# EAGLE design smartproj_ready (EAGLE 9.6.0)
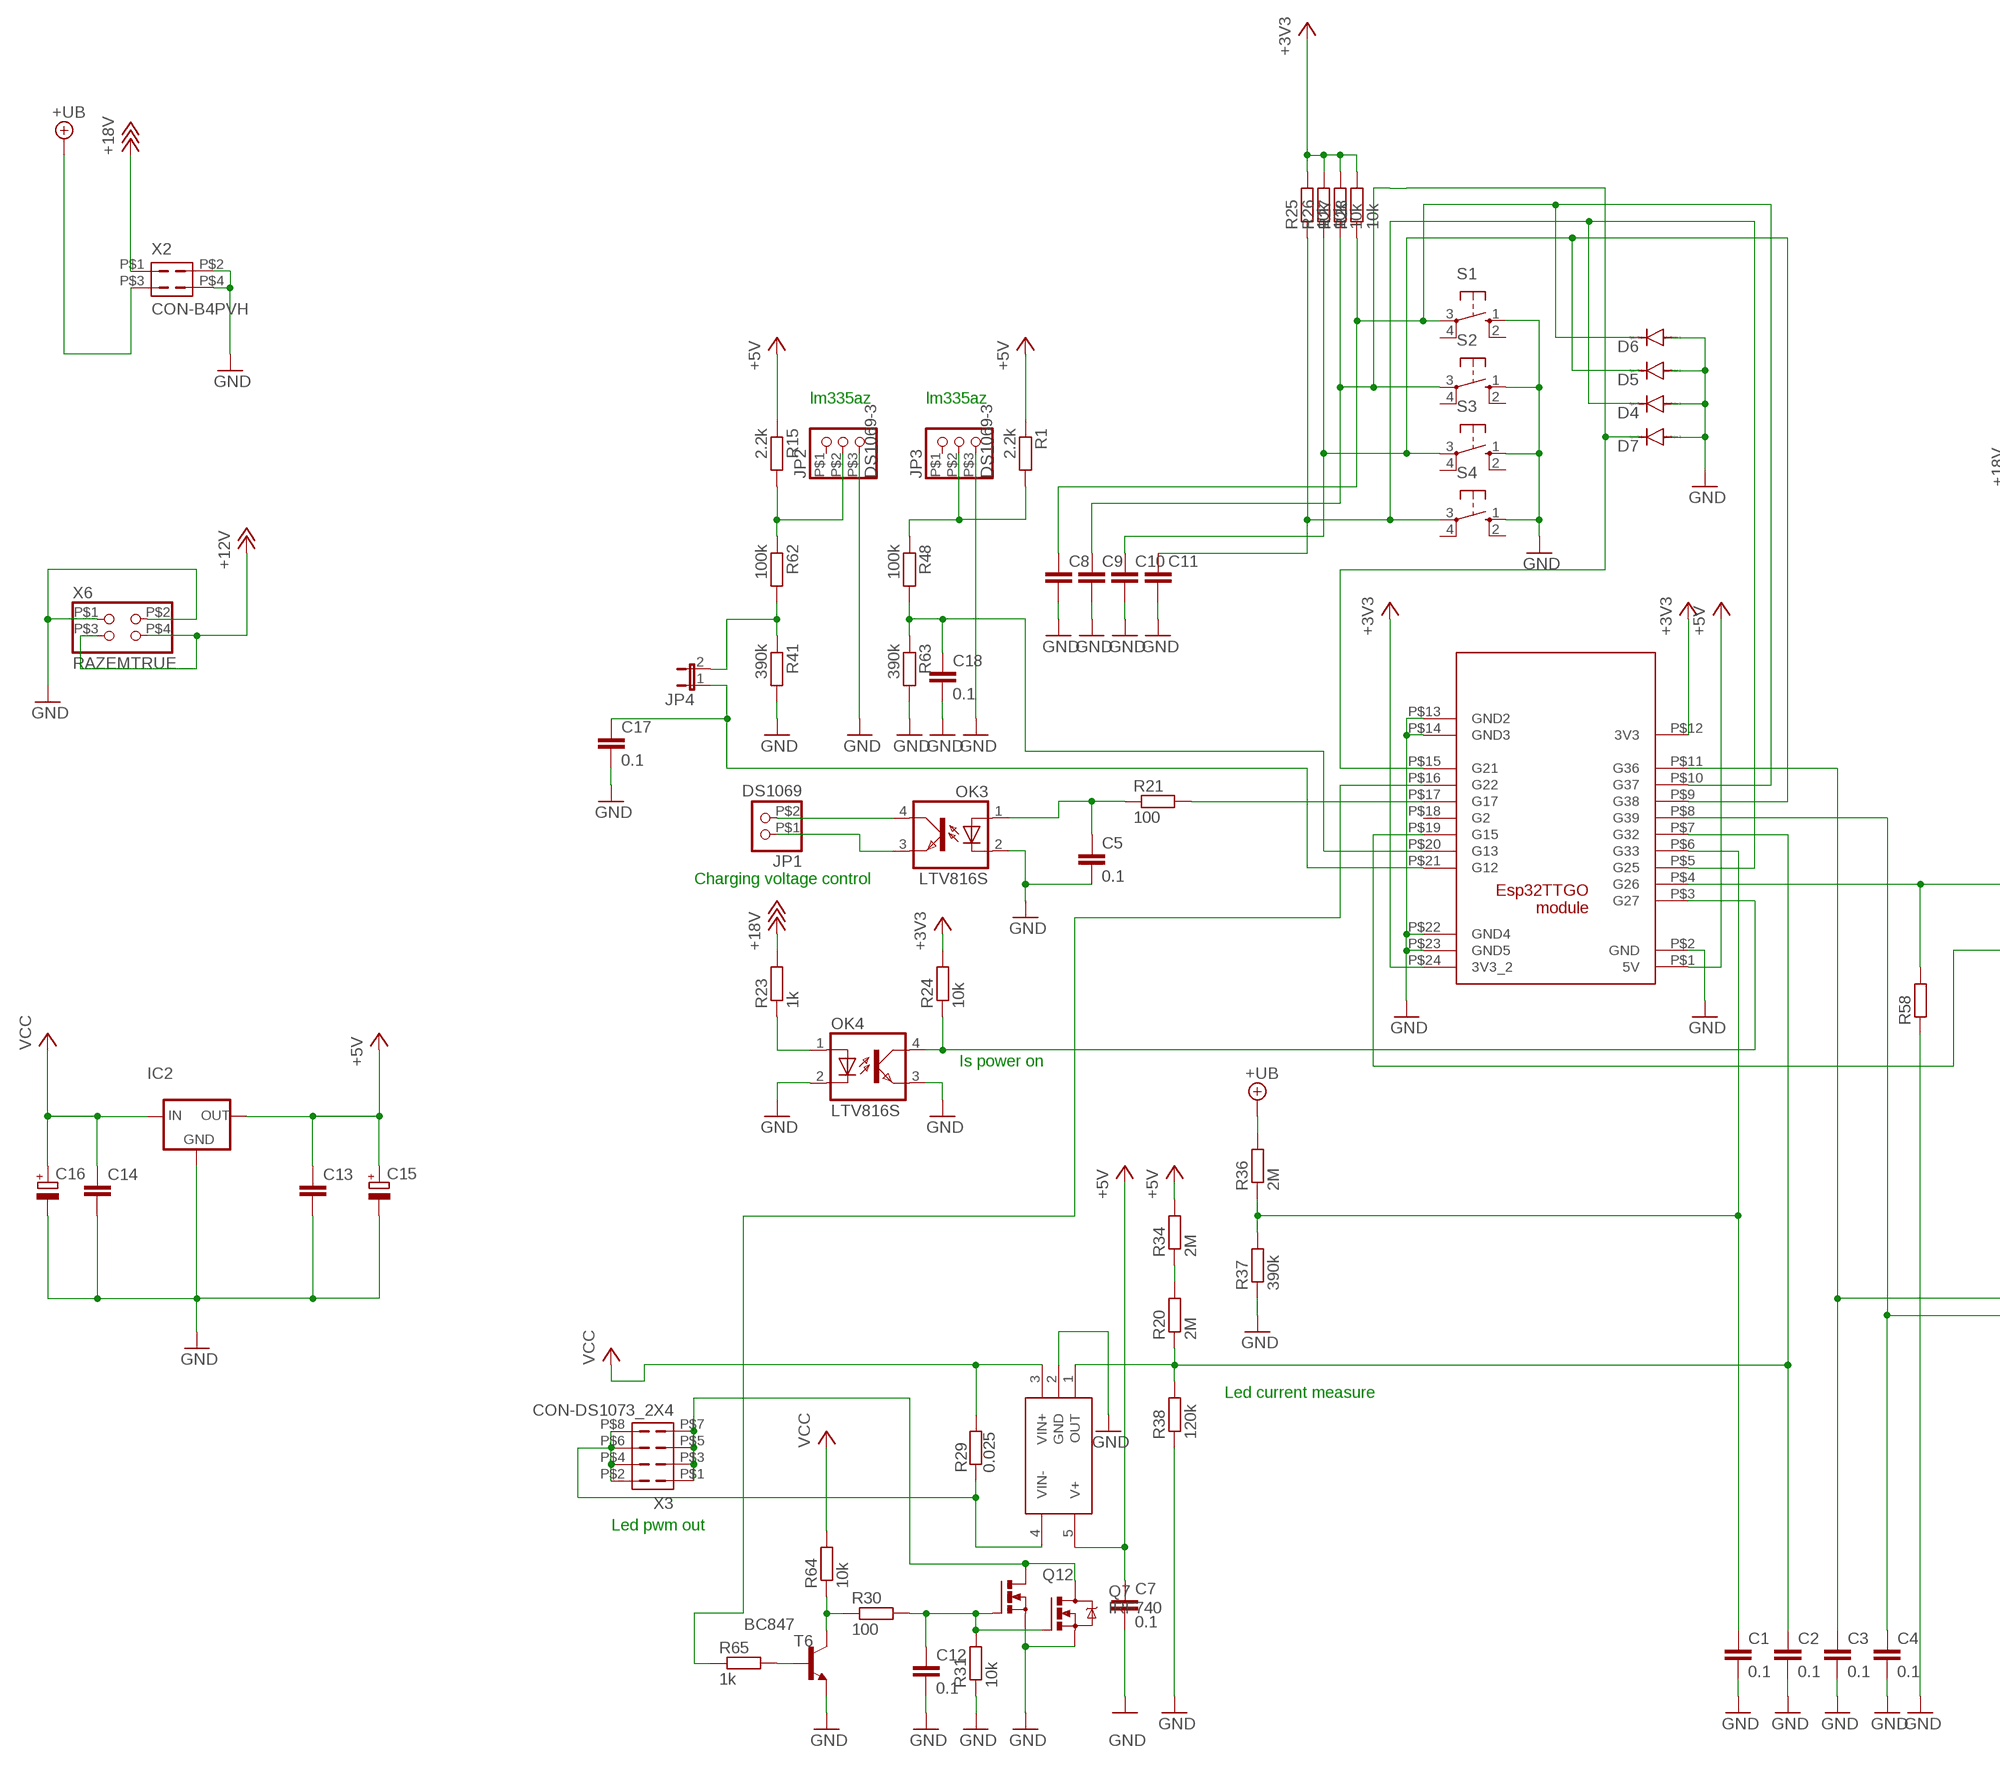
[diagram p0: schematic, sheet 1, part 1 of 2]
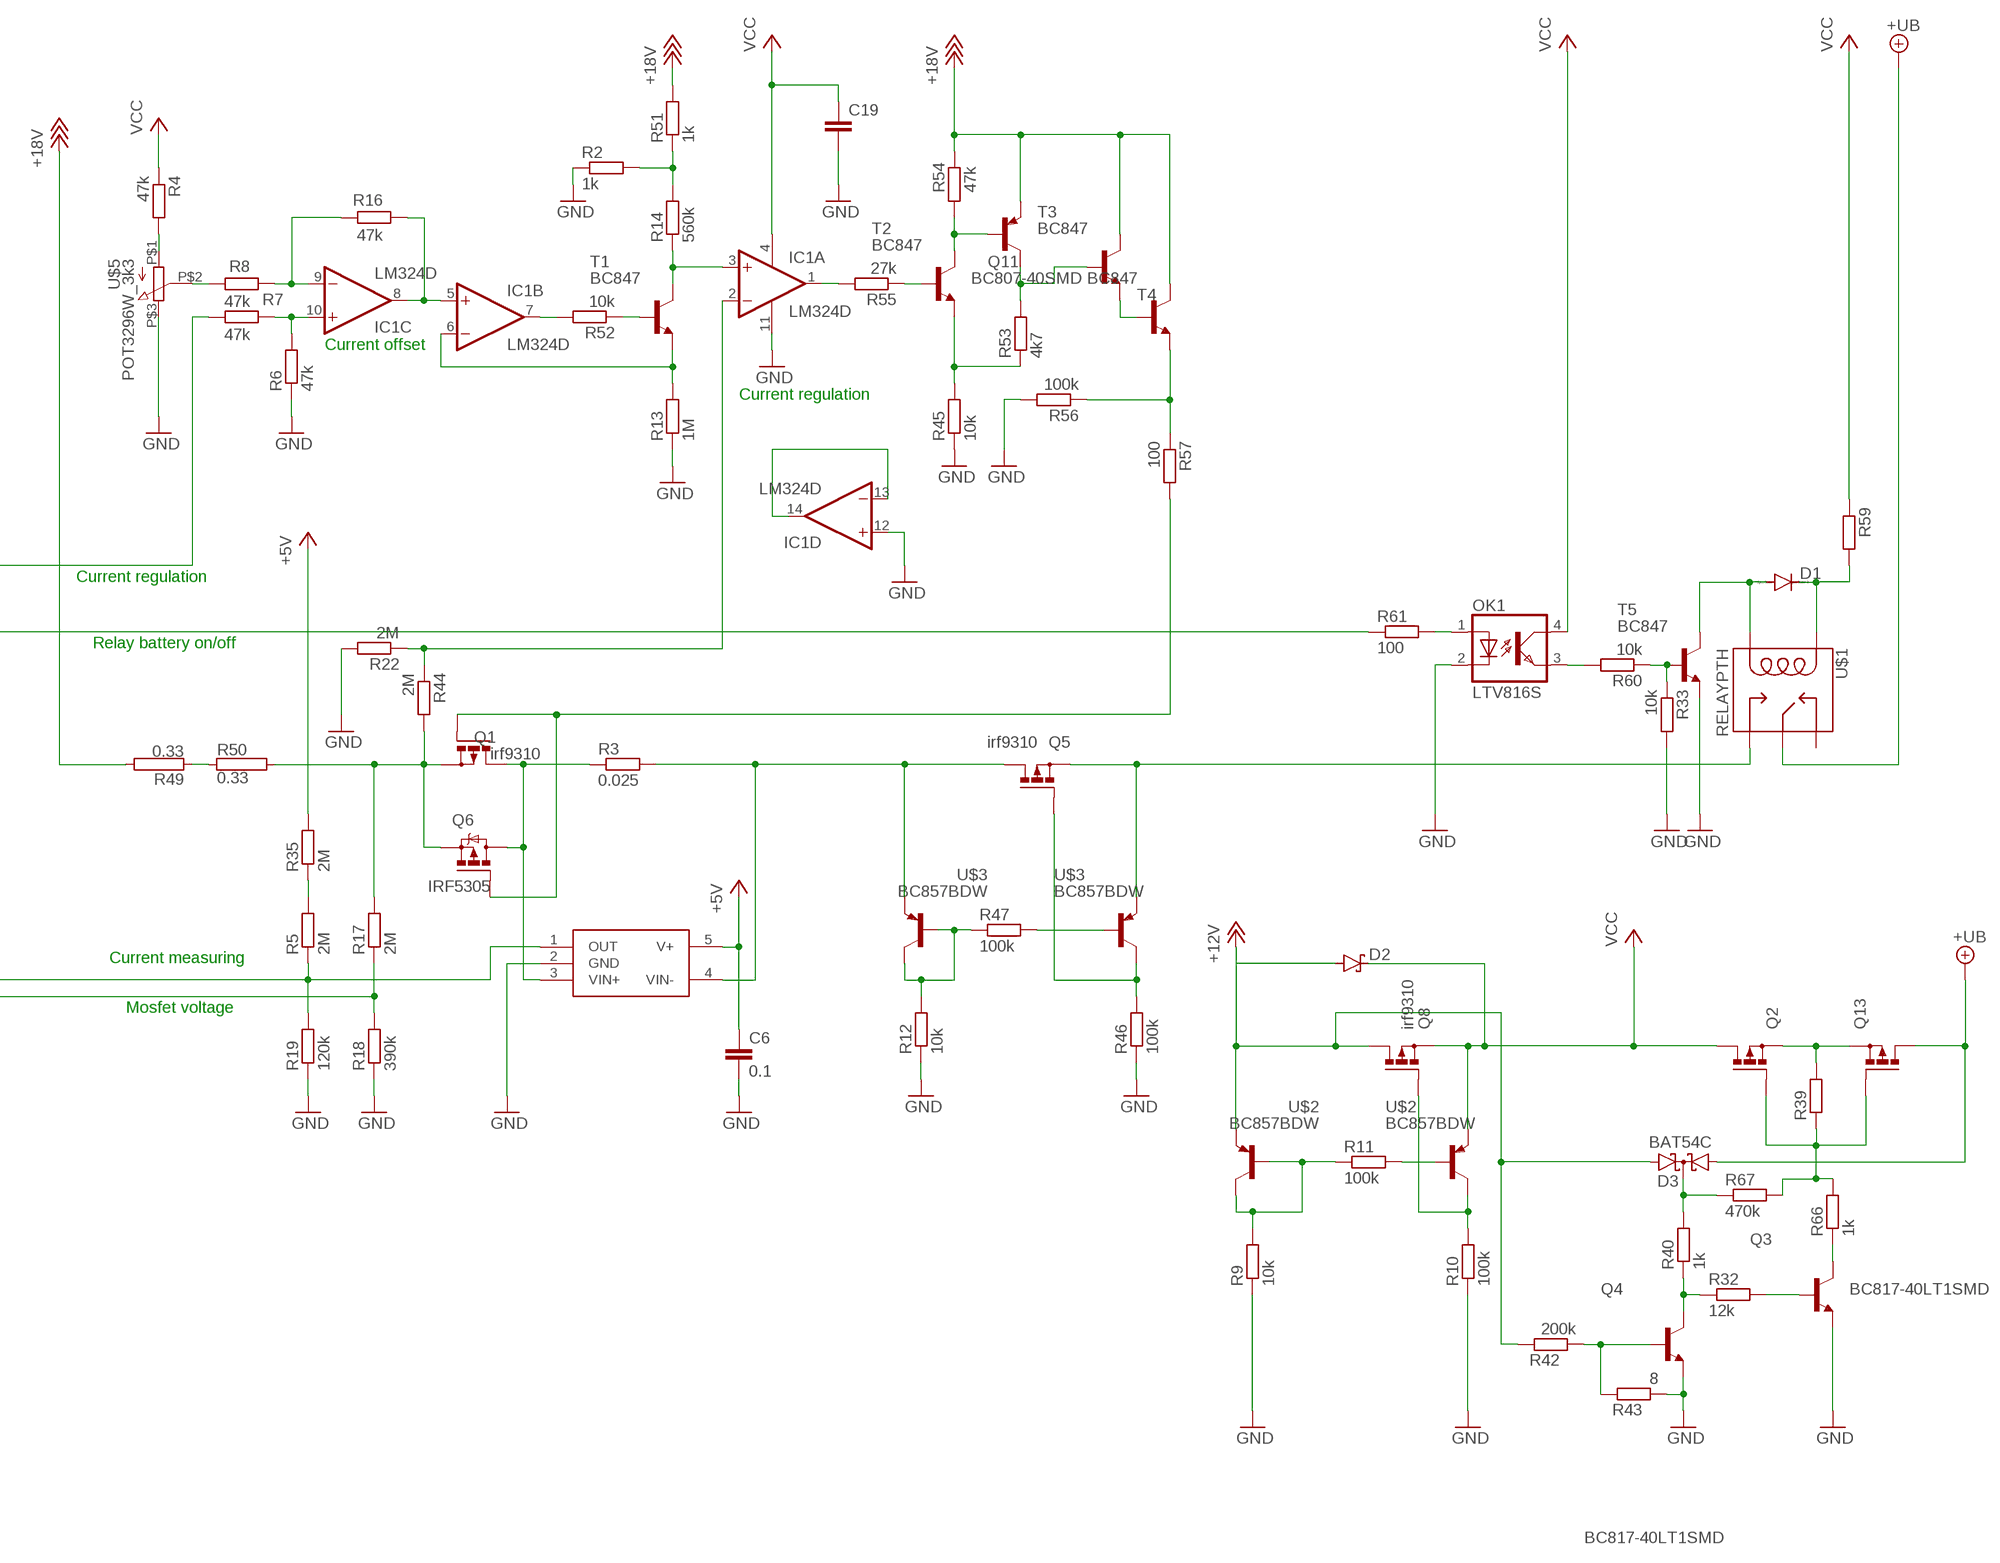
[diagram p1: schematic, sheet 1, part 2 of 2]

## Parts
C1  0.1  C-EUC0603K  [C0603K]
C2  0.1  C-EUC0603K  [C0603K]
C3  0.1  C-EUC0603K  [C0603K]
C4  0.1  C-EUC0603K  [C0603K]
C5  0.1  C-EUC0603K  [C0603K]
C6  0.1  C-EUC0603K  [C0603K]
C7  0.1  C-EUC0603K  [C0603K]
C8  C-EUC0603K  [C0603K]
C9  C-EUC0603K  [C0603K]
C10  C-EUC0603K  [C0603K]
C11  C-EUC0603K  [C0603K]
C12  0.1  C-EUC0603K  [C0603K]
C13  C-EUC0603  [C0603]
C14  C-EUC0603  [C0603]
C15  CPOL-EUSMCE  [SMC_E]
C16  CPOL-EUSMCE  [SMC_E]
C17  0.1  C-EUC0603K  [C0603K]
C18  0.1  C-EUC0603K  [C0603K]
C19  C-EUC0603K  [C0603K]
D1  DIODE-DO214AC  [DO214AC]
D2  SCHOTTKY-DIODESMC  [SMC]
D3  BAT54C  [SOT23]
D4  DIODE-SOD323-W  [SOD323-W]
D5  DIODE-SOD323-W  [SOD323-W]
D6  DIODE-SOD323-W  [SOD323-W]
D7  DIODE-SOD323-W  [SOD323-W]
IC1  LM324D  [SO14]
IC2  78XXS  [78XXS]
JP1  DS1069  [DS1069-2]
JP2  DS1069-3  [DS1069-3]
JP3  DS1069-3  [DS1069-3]
JP4  JP1E  [JP1]
OK1  LTV816S  [DIL4-SMD]
OK3  LTV816S  [DIL4-SMD]
OK4  LTV816S  [DIL4-SMD]
Q1  irf9310  P-MOSFET-SO8  [SO-08]
Q2  P-MOSFET-SO8  [SO-08]
Q3  BC817-40LT1SMD  [SOT23-BEC]
Q4  BC817-40LT1SMD  [SOT23-BEC]
Q5  irf9310  P-MOSFET-SO8  [SO-08]
Q6  IRF5305  IRF9530  [TO220BV]
Q7  IRF740  [TO220BV]
Q8  irf9310  P-MOSFET-SO8  [SO-08]
Q11  BC807-40SMD  [SOT23-BEC]
Q12  N-MOSFET-SO8S  [SO-08]
Q13  P-MOSFET-SO8  [SO-08]
R1  2.2k  R-EU_R0603  [R0603]
R2  1k  R-EU_R0603  [R0603]
R3  0.025  R-EU_R2512  [R2512]
R4  47k  R-EU_R0603  [R0603]
R5  2M  R-EU_R0603  [R0603]
R6  47k  R-EU_R0603  [R0603]
R7  47k  R-EU_R0603  [R0603]
R8  47k  R-EU_R0603  [R0603]
R9  10k  R-EU_R0603  [R0603]
R10  100k  R-EU_R0603  [R0603]
R11  100k  R-EU_R0603  [R0603]
R12  10k  R-EU_R0603  [R0603]
R13  1M  R-EU_R0603  [R0603]
R14  560k  R-EU_R0603  [R0603]
R15  2.2k  R-EU_R0603  [R0603]
R16  47k  R-EU_R0603  [R0603]
R17  2M  R-EU_R0603  [R0603]
R18  390k  R-EU_R0603  [R0603]
R19  120k  R-EU_R0603  [R0603]
R20  2M  R-EU_R0603  [R0603]
R21  100  R-EU_R0603  [R0603]
R22  2M  R-EU_R0603  [R0603]
R23  1k  R-EU_R0603  [R0603]
R24  10k  R-EU_R0603  [R0603]
R25  10k  R-EU_R0603  [R0603]
R26  10k  R-EU_R0603  [R0603]
R27  10k  R-EU_R0603  [R0603]
R28  10k  R-EU_R0603  [R0603]
R29  0.025  R-EU_R2512  [R2512]
R30  100  R-EU_R0603  [R0603]
R31  10k  R-EU_R0603  [R0603]
R32  12k  R-EU_R0603  [R0603]
R33  10k  R-EU_R0603  [R0603]
R34  2M  R-EU_R0603  [R0603]
R35  2M  R-EU_R0603  [R0603]
R36  2M  R-EU_R0603  [R0603]
R37  390k  R-EU_R0603  [R0603]
R38  120k  R-EU_R0603  [R0603]
R39  R-EU_R0603  [R0603]
R40  1k  R-EU_R0603  [R0603]
R41  390k  R-EU_R0603  [R0603]
R42  200k  R-EU_R0603  [R0603]
R43  8  R-EU_R0603  [R0603]
R44  2M  R-EU_R0603  [R0603]
R45  10k  R-EU_R0603  [R0603]
R46  100k  R-EU_R0603  [R0603]
R47  100k  R-EU_R0603  [R0603]
R48  100k  R-EU_R0603  [R0603]
R49  0.33  RCA4220  [CA4220]
R50  0.33  RCA4220  [CA4220]
R51  1k  R-EU_R0603  [R0603]
R52  10k  R-EU_R0603  [R0603]
R53  4k7  R-EU_R0603  [R0603]
R54  47k  R-EU_R0603  [R0603]
R55  27k  R-EU_R0603  [R0603]
R56  100k  R-EU_R0603  [R0603]
R57  100  R-EU_R0603  [R0603]
R58  R-EU_R0603  [R0603]
R59  R-EU_R1206  [R1206]
R60  10k  R-EU_R0603  [R0603]
R61  100  R-EU_R0603  [R0603]
R62  100k  R-EU_R0603  [R0603]
R63  390k  R-EU_R0603  [R0603]
R64  10k  R-EU_R0603  [R0603]
R65  1k  R-EU_R0603  [R0603]
R66  1k  R-EU_R0603  [R0603]
R67  470k  R-EU_R0603  [R0603]
S1  10-XX  [B3F-10XX]
S2  10-XX  [B3F-10XX]
S3  10-XX  [B3F-10XX]
S4  10-XX  [B3F-10XX]
T1  BC847  [SOT23]
T2  BC847  [SOT23]
T3  BC847  [SOT23]
T4  BC847  [SOT23]
T5  BC847  [SOT23]
T6  BC847  [SOT23]
U1  ESP32TTGO  [ESP32TTGODIP]
U3  INA138  [SOT23-DBV]
U4  INA138  [SOT23-DBV]
U$1  RELAYPTH  [SRD-05VDC-SL-C]
U$2  BC857BDW  [SOT363-INFINION]
U$3  BC857BDW  [SOT363-INFINION]
U$5  POT3296W_3k3  POT3296W  [3296W]
X2  CON-B4PVH  [B4PVH4]
X3  CON-DS1073_2X4  [DS1073_2X4]
X6  RAZEMTRUE  [DS1073_2X2N2]

## Nets
+3V3: R24.2 R25.2 R26.2 R27.2 R28.2 U1.P$12(3V3) U1.P$24(3V3_2)
+5V: C6.1 C7.1 C13.1 C15.+ IC2.OUT R1.1 R15.1 R34.2 R35.2 U1.P$1(5V) U3.5(V+) U4.5(V+)
+12V: D2.A D3.2(A2) Q8.5(D) Q8.6(D) Q8.7(D) Q8.8(D) R42.2 U$2.1(E1) X6.P$3 X6.P$4
+18V: Q11.E R23.2 R49.2 R51.2 R54.2 T3.3(C) T4.3(C) X2.P$1
+UB: D3.1(A1) Q13.5(D) Q13.6(D) Q13.7(D) Q13.8(D) R36.2 U$1.SWCOMMON X2.P$3
GND: C1.2 C2.2 C3.2 C4.2 C5.2 C6.2 C7.2 C8.2 C9.2 C10.2 C11.2 C12.2 C13.2 C14.2 C15.- C16.- C17.2 C18.2 C19.2 D4.A D5.A D6.A D7.A IC1.11(P:V-) IC1.12(D:+IN) IC2.GND JP2.P$3 JP3.P$3 OK1.2(C) OK3.2(C) OK4.2(C) OK4.3(EMIT) Q3.E Q4.E Q7.S Q12.1(S) Q12.2(S) Q12.3(S) R2.1 R6.1 R9.1 R10.1 R12.1 R13.1 R18.1 R19.1 R22.2 R31.1 R33.2 R37.1 R38.1 R41.2 R43.1 R45.1 R46.1 R56.2 R58.1 R63.2 S1.1(S) S2.1(S) S3.1(S) S4.1(S) T5.2(E) T6.2(E) U1.P$2(GND) U1.P$13(GND2) U1.P$14(GND3) U1.P$22(GND4) U1.P$23(GND5) U3.2(GND) U4.2(GND) U$5.P$3(E) X2.P$2 X2.P$4 X6.P$1 X6.P$2
N$1: R49.1 R50.1
N$2: OK1.3(EMIT) R60.2
N$3: Q4.B R42.1 R43.2
N$4: Q4.C R32.1 R40.1
N$5: Q3.B R32.2
N$6: Q2.4(G) Q13.4(G) R39.1 R66.2 R67.2
N$7: Q1.1(S) Q1.2(S) Q1.3(S) Q6.S R17.2 R44.2 R50.2
N$8: D3.3(CC) R40.2 R67.1
N$9: Q1.5(D) Q1.6(D) Q1.7(D) Q1.8(D) Q6.D R3.1 U3.3(VIN+)
N$10: R4.2 U$5.P$1(A)
N$11: IC1.10(C:+IN) R6.2 R7.1
N$12: IC1.9(C:-IN) R8.1 R16.2
N$13: C1.1 R36.1 R37.2 U1.P$6(G33)
N$14: R11.2 U$2.5(B)
N$15: R52.1 T1.1(B)
N$16: IC1.13(D:-IN) IC1.14(D:OUT)
N$17: R9.2 R11.1 U$2.2(B1) U$2.6(C1)
N$18: Q8.4(G) R10.2 U$2.3(C)
N$19: IC1.3(A:+IN) R14.1 T1.3(C)
N$20: Q5.4(G) R46.2 U$3.3(C)
N$21: IC1.6(B:-IN) R13.2 T1.2(E)
N$22: IC1.1(A:OUT) R55.2
N$23: R8.2 U$5.P$2(S)
N$24: R20.2 R34.1
N$25: IC1.5(B:+IN) IC1.8(C:OUT) R16.1
N$26: C5.1 OK3.1(A) R21.1
N$27: JP1.P$2 OK3.4(COL)
N$28: JP1.P$1 OK3.3(EMIT)
N$29: OK4.1(A) R23.1
N$30: IC1.2(A:-IN) R22.1 R44.1
N$31: R5.2 R35.1
N$32: R55.1 T2.1(B)
N$33: OK4.4(COL) R24.1 U1.P$3(G27)
N$34: R12.2 R47.1 U$3.2(B1) U$3.6(C1)
N$35: R30.1 R64.1 T6.3(C)
N$36: IC1.7(B:OUT) R52.2
N$37: C11.1 D4.C R25.1 S4.3(P) U1.P$5(G25)
N$38: C10.1 D5.C R26.1 S3.3(P) U1.P$9(G38)
N$39: R2.2 R14.2 R51.1
N$40: R47.2 U$3.5(B)
N$41: R45.2 R53.1 T2.2(E)
N$42: Q2.1(S) Q2.2(S) Q2.3(S) Q13.1(S) Q13.2(S) Q13.3(S) R39.2
N$43: Q5.1(S) Q5.2(S) Q5.3(S) U$1.SWOPEN U$3.4(E)
N$44: Q7.D Q12.5(D) Q12.6(D) Q12.7(D) Q12.8(D) X3.P$1 X3.P$3 X3.P$5 X3.P$7
N$45: R21.2 U1.P$17(G17)
N$46: R65.1 U1.P$16(G22)
N$47: R7.2 R58.2 U1.P$4(G26)
N$48: C3.1 R5.1 R19.2 U1.P$11(G36) U3.1(OUT)
N$49: Q11.C R53.2 T3.1(B)
N$50: C17.1 JP4.1 U1.P$21(G12)
N$51: C4.1 R17.1 R18.2 U1.P$8(G39)
N$52: Q5.5(D) Q5.6(D) Q5.7(D) Q5.8(D) R3.2 U3.4(VIN-) U$3.1(E1)
N$53: JP3.P$2 R1.2 R48.1
N$54: Q11.B R54.1 T2.3(C)
N$55: C2.1 R20.1 R38.2 U1.P$7(G32) U4.1(OUT)
N$56: JP2.P$2 R15.2 R62.1
N$57: C12.1 Q7.G Q12.4(G) R30.2 R31.2
N$58: R65.2 T6.1(B)
N$59: JP4.2 R41.1 R62.2
N$60: Q3.C R66.1
N$61: C18.1 R48.2 R63.1 U1.P$20(G13)
N$62: C8.1 D6.C R28.1 S1.3(P) U1.P$10(G37)
N$64: C9.1 D7.C R27.1 S2.3(P) U1.P$15(G21)
N$65: R56.1 R57.1 T4.2(E)
N$66: D1.A T5.3(C) U$1.COIL0
N$67: T3.2(E) T4.1(B)
N$68: Q1.4(G) Q6.G R57.2
N$69: D1.C R59.2 U$1.COIL1
N$71: R33.1 R60.1 T5.1(B)
N$72: R61.1 U1.P$19(G15)
N$73: OK1.1(A) R61.2
N$74: R29.1 U4.4(VIN-) X3.P$2 X3.P$4 X3.P$6 X3.P$8
VCC: C14.1 C16.+ C19.1 D2.C IC1.4(P:V+) IC2.IN OK1.4(COL) Q2.5(D) Q2.6(D) Q2.7(D) Q2.8(D) Q8.1(S) Q8.2(S) Q8.3(S) R4.1 R29.2 R59.1 R64.2 U4.3(VIN+) U$2.4(E)
Unconnected: JP2.P$1 JP3.P$1 S1.2(S1) S1.4(P1) S2.2(S1) S2.4(P1) S3.2(S1) S3.4(P1) S4.2(S1) S4.4(P1) U1.P$18(G2) U$1.SWCLOSED(SWCLOSE)

## Notes on the sheet
- lm335az | lm335az
- Current offset
- Current regulation
- Charging voltage control
- Current regulation
- Relay battery on/off
- Is power on
- Current measuring
- Mosfet voltage
- Led current measure
- Led pwm out

## Library data of the parts
C1-C14 C17-C19 = rcl:C-EU: CAPACITOR, European symbol; SPICEPREFIX: C
C15 C16 = rcl:CPOL-EU: POLARIZED CAPACITOR, European symbol; SPICEPREFIX: C
D1 D4-D7 = diode:DIODE-: DIODE
D2 = diode:SCHOTTKY-DIODE: Schottky Diode
D3 = diode:BAT54C: Schottky Diodes Source: Fairchild .. BAT54.pdf
IC1 = linear:LM324: OP AMP
IC2 = v-reg:78XXS: VOLTAGE REGULATOR
JP1 = ds1069:DS1069
JP2 JP3 = ds1069:DS1069-3
JP4 = jumper:JP1E: JUMPER
OK1 OK3 OK4 = optocoupler:LTV816: OPTO COUPLER Source: LITEON, LTV816.pdf
Q1 Q2 Q5 Q8 Q13 = transistor-power:P-MOSFET-SO8: P-Channel MOSFET Example: FDS4435A; P-Channel Logic Level PowerTrench® MOSFET FDS4465; P-Channel 1.8V Specified PowerTrench® MOSFET Source: www.fairchildsemi.com
Q3 Q4 = transistor-npn:BC817*: NPN Transistor
Q6 = transistor-power:IRF9530: P-CHANNEL HEXFET POWER-MOS-FET Source: http://www.irf.com/product-info/datasheets/data/irf9530.pdf
Q7 = transistor-power:IRF740: N-CHANNEL MOS FET
Q11 = transistor-pnp:BC807*: PNP Transistror
Q12 = transistor-power:N-MOSFET-SO8: N-Channel MOSFET Example: FDS7760A; N-Channel Logic Level PowerTrench® MOSFET FDS2572; N-Channel UltraFET® Trench MOSFET Source: www.fairchildsemi.com
R1 R4-R8 R15-R22 R30 R31 R34 R35 R38 R41 R44 R48 R62-R65 = resistor:R-EU_: RESISTOR, European symbol
R2 R3 R9-R14 R23-R29 R32 R33 R36 R37 R39 R40 R42 R43 R45-R47 R51-R61 R66 R67 = rcl:R-EU_: RESISTOR, European symbol; SPICEPREFIX: R
R49 R50 = resistor-power:R: Power Resitor; OC_FARNELL: unknown; OC_NEWARK: unknown
S1-S4 = switch-omron:10-XX: OMRON SWITCH; MPN: B3F-1000; OC_FARNELL: 176432; OC_NEWARK: 36M3542
T1-T6 = transistor:BC847: NPN TRANSISTOR
U1 = esp32TTGO:ESP32TTGO
U3 U4 = ina138:INA138
U$1 = srd:RELAY: SPDT relay (COM-00101)
U$2 U$3 = bc857bdw:BC857BDW
U$5 = pot3296W:POT3296W
X2 = b4pvh:CON-B4PVH
X3 = con-ds1073fpp:CON-DS1073_2X4
X6 = con-ds1073fpp:RAZEM

## Board
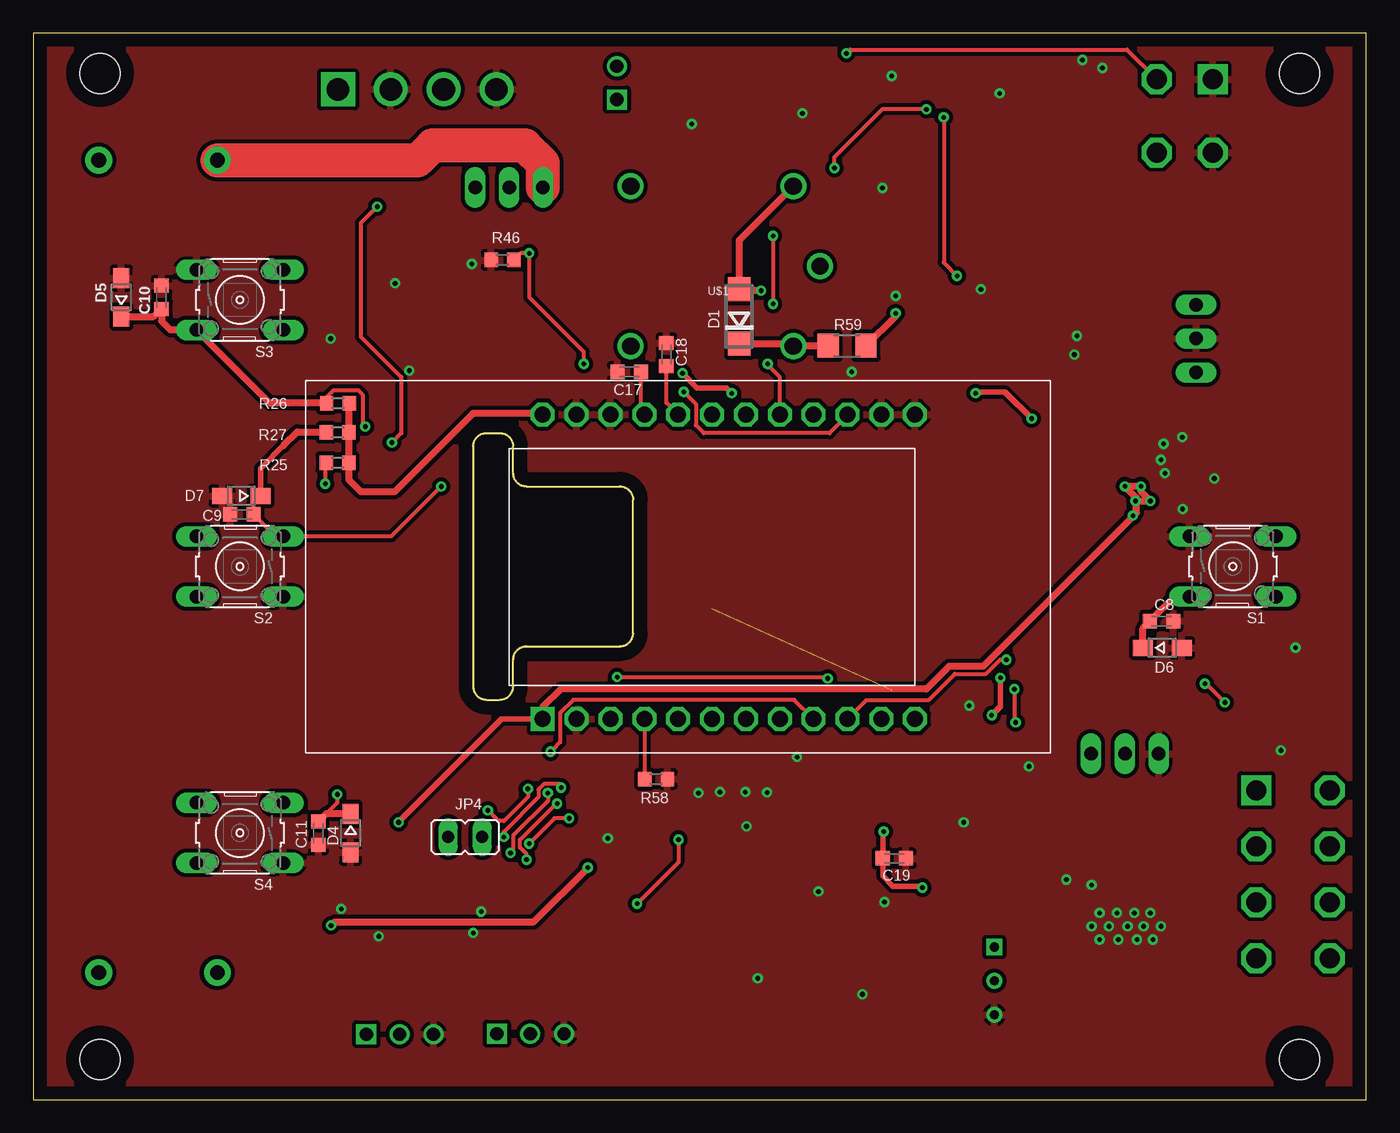
[diagram p2: board, top side]
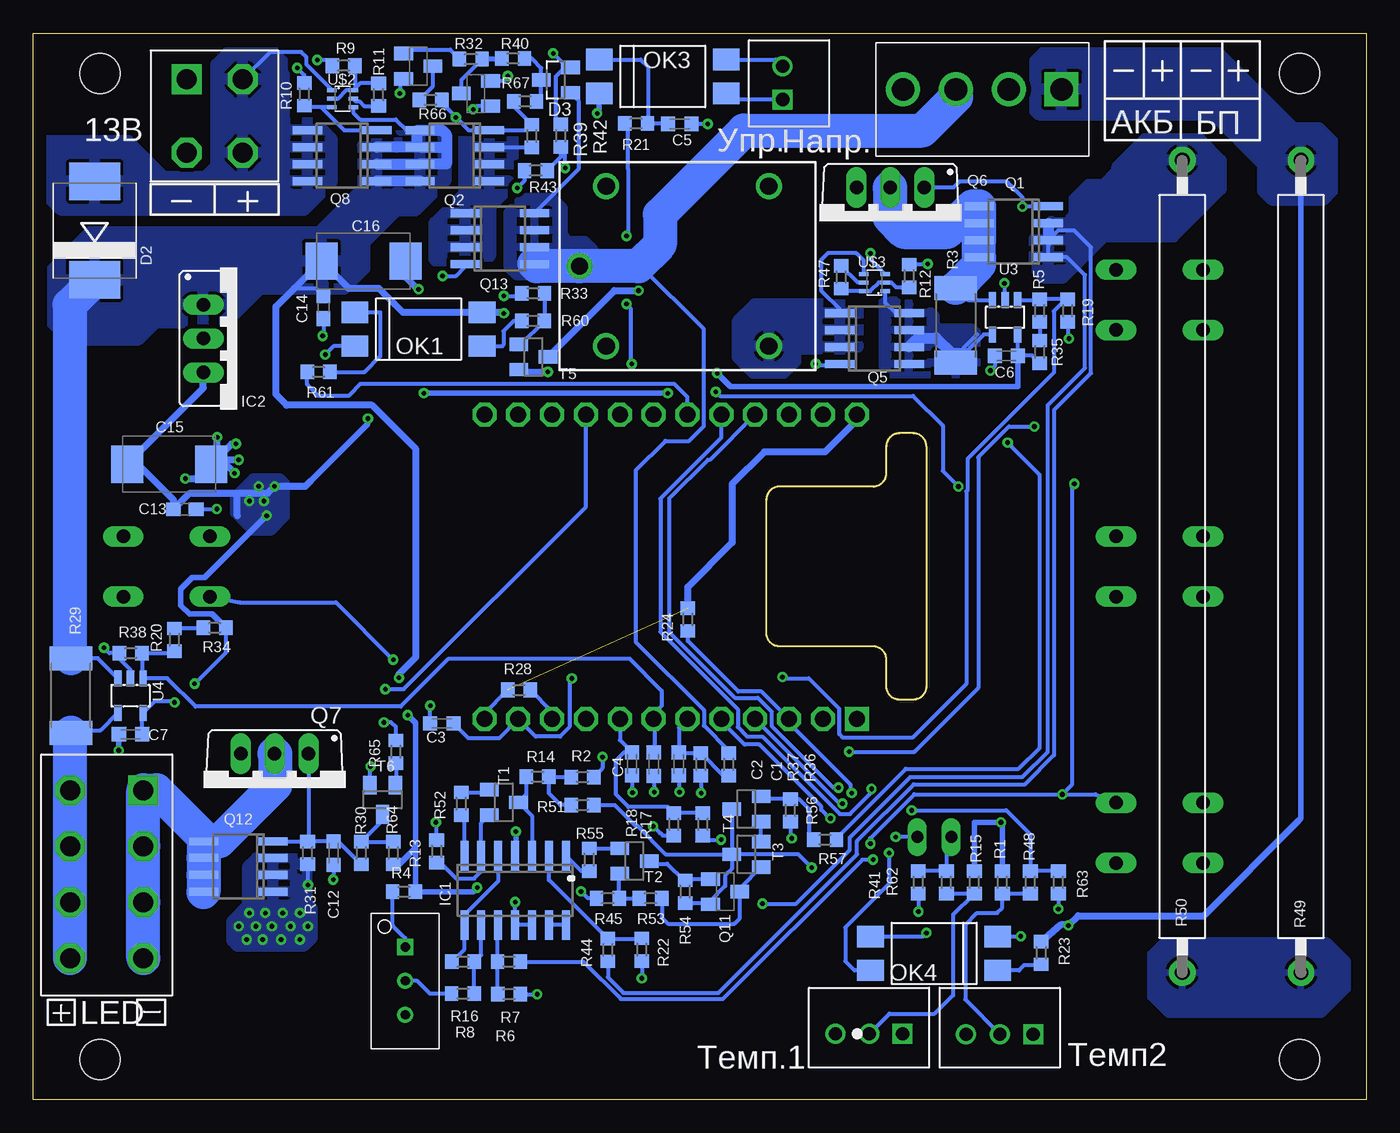
[diagram p3: board, bottom side, seen from below]

Size 100 x 80 mm. Coordinates in mm from the lower left corner, seen from the top.
Outline: 0,0 100,0 100,80 0,80 0,0
Outline: 33,49 33,31 arc90 34,30 35,30 arc90 36,31 36,33 arc-90 37,34 44,34 arc90 45,35 45,45 arc90 44,46 37,46 arc-90 36,47 36,49 arc90 35,50 34,50 arc90 33,49
Copper layers (1*16): Top 0.035mm / dielectric 1.5mm / Bottom 0.035mm
Design rules "default *": minimum track width 6mil, minimum drill 0.35mm, track to track 6mil, track to pad 6mil, pad to pad 6mil, via to via 6mil, smd to smd 6mil, copper to edge 40mil, drill to drill 6mil, minimum pad ring 10mil, minimum via ring 8mil, stop-mask expansion 4mil, vias tented up to drill 14mil, thermal gap 10mil
Holes 3 mm at 5,77 95,77 5,3 95,3
Milling: 16 lines

### Footprints (pad centres in the part's own frame; a part is rotated, then mirrored left to right if it is on the bottom)
C0603K = smd 1.05 x 1.08: 1 -0.875,0; 2 0.875,0
C0603 = smd 1.1 x 1: 1 -0.85,0; 2 0.85,0
SMC_E = smd 2.4 x 2.8: + -3.15,0; - 3.15,0
DO214AC = smd 1.8 x 1.7: A 2.05,0; C -2.05,0
SMC = smd 2.8 x 3.8: A 3.7,0; C -3.7,0
SOT23 = smd 1 x 1.4: 1 -0.95,-1.1; 2 0.95,-1.1; 3 0,1.1
SOD323-W = smd 1.5 x 1.2: A 1.45,0; C -1.45,0
SO14 = smd 0.6 x 2.2: 1 -3.81,-2.6; 2 -2.54,-2.6; 3 -1.27,-2.6; 4 0,-2.6; 5 1.27,-2.6; 6 2.54,-2.6; 7 3.81,-2.6; 8 3.81,2.6; 9 2.54,2.6; 10 1.27,2.6; 11 0,2.6; 12 -1.27,2.6; 13 -2.54,2.6; 14 -3.81,2.6
78XXS = drill 1.016 long: GND 0,-2.54; IN -2.54,-2.54; OUT 2.54,-2.54
DS1069-2 = drill 1 square: P$1 -1.25,0 | drill 1: P$2 1.25,0
DS1069-3 = drill 1 square: P$1 -2.52,0 | drill 1: P$2 -0.02,0; P$3 2.52,0
JP1 = drill 0.914 long: 1 0,-1.27; 2 0,1.27
DIL4-SMD = smd 1.6 x 2: 1 -1.27,-4.77; 2 1.27,-4.77; 3 1.27,4.77; 4 -1.27,4.77
SO-08 = smd 0.6 x 2.2: 1 -1.905,-2.6; 2 -0.635,-2.6; 3 0.635,-2.6; 4 1.905,-2.6; 5 1.905,2.6; 6 0.635,2.6; 7 -0.635,2.6; 8 -1.905,2.6
SOT23-BEC = smd 1 x 1.4: B -0.95,-1.1; C 0,1.1; E 0.95,-1.1
TO220BV = drill 1.016 long: D 0,-2.54; G -2.54,-2.54; S 2.54,-2.54
R0603 = smd 1 x 1.1: 1 -0.85,0; 2 0.85,0
R2512 = smd 1.8 x 3.2: 1 -2.8,0; 2 2.8,0
CA4220 = drill 1.1 pad 2: 1 -30.48,0; 2 30.48,0
R1206 = smd 1.6 x 1.803: 1 -1.422,0; 2 1.422,0
B3F-10XX = drill 1.016 long: 1 -3.251,2.261; 2 3.251,2.261; 3 -3.251,-2.261; 4 3.251,-2.261
ESP32TTGODIP = drill 1.2 square: P$1 -11.43,11.43 | drill 1.2 octagon: P$2 -11.43,8.89; P$3 -11.43,6.35; P$4 -11.43,3.81; P$5 -11.43,1.27; P$6 -11.43,-1.27; P$7 -11.43,-3.81; P$8 -11.43,-6.35; P$9 -11.43,-8.89; P$10 -11.43,-11.43; P$11 -11.43,-13.97; P$12 -11.43,-16.51; P$13 11.43,-16.51; P$14 11.43,-13.97; P$15 11.43,-11.43; P$16 11.43,-8.89; P$17 11.43,-6.35; P$18 11.43,-3.81; P$19 11.43,-1.27; P$20 11.43,1.27; P$21 11.43,3.81; P$22 11.43,6.35; P$23 11.43,8.89; P$24 11.43,11.43
SOT23-DBV = smd 0.55 x 1.2: 1 -0.95,-1.3; 2 0,-1.3; 3 0.95,-1.3; 4 0.95,1.3; 5 -0.95,1.3
SRD-05VDC-SL-C = drill 1.3: COIL0 -6.1,-6; COIL1 -6.1,6; SWCLOSED 6.1,-6; SWCOMMON -8.1,0; SWOPEN 6.1,6
SOT363-INFINION = smd 0.3 x 0.7: 1 -0.65,-0.8; 2 0,-0.8; 3 0.65,-0.8; 4 0.65,0.8; 5 0,0.8; 6 -0.65,0.8
3296W = drill 0.7 square: P$1 0,2.54 | drill 0.7: P$2 0,0; P$3 0,-2.54
B4PVH4 = drill 1.7 square: P$1 -5.94,0 | drill 1.7: P$2 -1.98,0; P$3 1.98,0; P$4 5.94,0
DS1073_2X4 = drill 1.5 square: P$1 -6.3,2.75 | drill 1.5 octagon: P$2 -6.3,-2.75; P$3 -2.1,2.75; P$4 -2.1,-2.75; P$5 2.1,2.75; P$6 2.1,-2.75; P$7 6.3,2.75; P$8 6.3,-2.75
DS1073_2X2N2 = drill 1.5 square: P$1 2.715,7.645 | drill 1.5 octagon: P$2 2.715,2.145; P$3 6.915,7.645; P$4 6.915,2.145

### Placement (x,y rotation side)
C1  51.57,25.18 270 bottom
C2  53.44,25.17 270 bottom
C3  69.34,28.22 180 bottom
C4  55.08,25.18 270 bottom
C5  51.5,73.21 0 bottom
C6  27,55.8 180 bottom
C7  92.7,27.4 180 bottom
C8  84.65,35.9 0 top
C9  15.65,43.9 180 top
C10  9.62,60.2 90 top
C11  21.39,19.99 270 top
C12  77.47,18.49 270 bottom
C13  88.63,44.29 0 bottom
C14  78.23,59.44 270 bottom
C15  89.81,47.67 0 bottom
C16  75.24,62.9 0 bottom
C17  44.7,54.6 180 top
C18  47.5,55.9 90 top
C19  64.6,18.1 0 top
D1  52.97,58.76 90 top
D2  95.4,65.2 90 bottom
D3  60.8,76.5 90 bottom
D4  23.8,20 270 top
D5  6.6,60.2 90 top
D6  84.7,33.9 0 top
D7  15.6,45.3 180 top
IC1  63.85,15.7 180 bottom
IC2  84.7,57.1 270 bottom
JP1  43.79,76.28 90 bottom
JP2  37.3,4.94 180 bottom
JP3  27.5,4.9 180 bottom
JP4  32.4,19.7 90 top
OK1  71.1,57.8 270 bottom
OK3  52.78,76.76 270 bottom
OK4  32.42,10.96 90 bottom
Q1  26.44,65.11 90 bottom
Q2  68.39,70.82 90 bottom
Q3  71.12,77.53 270 bottom
Q4  66.8,75.48 90 bottom
Q5  36.9,57.1 270 bottom
Q6  35.7,65.9 180 bottom
Q7  81.9,23.4 180 bottom
Q8  76.83,70.82 90 bottom
Q11  48.1,15.6 270 bottom
Q12  84.62,17.48 90 bottom
Q13  65,64.6 270 bottom
R1  27.3,16.3 270 bottom
R2  58.8,24.2 180 bottom
R3  30.8,58.1 270 bottom
R4  72.19,15.59 180 bottom
R5  24.5,59.2 270 bottom
R6  64.31,7.9 180 bottom
R7  64.32,10.35 0 bottom
R8  67.77,7.95 180 bottom
R9  76.72,77.57 0 bottom
R10  79.67,75.42 270 bottom
R11  74.1,75.4 270 bottom
R12  34.3,61.8 270 bottom
R13  69.74,18.62 270 bottom
R14  62.17,24.22 0 bottom
R15  29.4,16.3 270 bottom
R16  67.75,10.34 0 bottom
R17  49.77,20.65 270 bottom
R18  51.95,20.65 90 bottom
R19  22.4,59.2 90 bottom
R20  89.4,34.5 90 bottom
R21  54.77,73.23 180 bottom
R22  54.35,11.25 270 bottom
R23  24.38,10.99 90 bottom
R24  50.9,36.01 90 bottom
R25  22.83,47.78 0 top
R26  22.86,52.25 0 top
R27  22.84,50.05 0 top
R28  63.56,30.73 180 bottom
R29  97.19,30.31 90 bottom
R30  75.39,18.49 270 bottom
R31  79.42,18.51 90 bottom
R32  67.18,78.07 180 bottom
R33  62.5,60.5 180 bottom
R34  86.4,35.4 0 bottom
R35  24.5,56.1 270 bottom
R36  47.83,25.15 90 bottom
R37  49.92,25.15 90 bottom
R38  92.7,33.5 0 bottom
R39  62.6,72.3 270 bottom
R40  63.99,78.12 0 bottom
R41  33.6,16.3 270 bottom
R42  60.44,72.32 90 bottom
R43  62.3,69.7 0 bottom
R44  56.9,11.22 270 bottom
R45  56.9,15.1 0 bottom
R46  35.2,63 0 top
R47  39.4,61.7 90 bottom
R48  25.2,16.3 90 bottom
R49  4.9,40 90 bottom
R50  13.8,40 90 bottom
R51  58.8,22.1 0 bottom
R52  67.9,22.2 270 bottom
R53  53.7,15.1 0 bottom
R54  51.1,15.6 270 bottom
R55  58.3,18 270 bottom
R56  43.2,21.7 270 bottom
R57  40.6,19.5 0 bottom
R58  46.73,24.05 180 top
R59  61.05,56.56 180 top
R60  62.51,58.42 180 bottom
R61  78.6,54.6 0 bottom
R62  31.5,16.3 90 bottom
R63  23.1,16.3 270 bottom
R64  73,18.5 270 bottom
R65  72.8,26.1 270 bottom
R66  70.2,75 0 bottom
R67  63.1,74.9 180 bottom
S1  90,40 0 top
S2  15.5,40 180 top
S3  15.5,60 0 top
S4  15.5,20 180 top
T1  64.7,22.3 270 bottom
T2  54.9,17.9 270 bottom
T3  46.5,18.4 90 bottom
T4  46.5,21.8 90 bottom
T5  62.48,55.72 270 bottom
T6  73.8,22.5 180 bottom
U1  49.65,39.97 90 top
U3  27.1,58.7 180 bottom
U4  92.7,30.3 180 bottom
U$1  50.92,62.53 180 top
U$2  76.8,75.1 270 bottom
U$3  36.9,61.3 90 bottom
U$5  72.1,8.9 0 bottom
X2  28.8,75.8 180 bottom
X3  94.5,16.9 270 bottom
X6  91.2,68.9 0 bottom

### Tracks (layer width: path | path; a pad name or v marks a point on that pad's centre or on a via)
+3V3  (1 unrouted)
  Top 0.508: U1.P$24 38.14,51.48 32.98,51.48 27.09,45.58 24.58,45.58 23.68,46.48 R25.2 23.68,50.04 R27.2 23.69,52.22 R26.2
  Bottom 0.305: U1.P$12 66.16,28.98 R28.2
  Bottom 0.508: U1.P$24 38.22,50.98 40.6,48.6 45.15,48.6 47.57,46.18 47.57,41.79 50.9,38.46 R24.2
+5V  (via drill 0.35)
  Top 0.305: v89.4,29.8 88,31.2 v87.9,31.2
  Top 0.406: v52.4,53 52,53.4 49.8,53.4 v48.7,54.5 | v70.7,53 70.8,53.1 72.9,53.1 v74.9,51.1 | U1.P$1 35.12,28.54 27.48,20.9 27.48,20.88 v27.4,20.8
  Top 0.508: U1.P$1 38.22,29.44 39.58,30.8 67,30.8 68.7,32.5 71.25,32.5 82.77,44.02 82.77,45.14 v81.9,46.01 v83.1,46.01 83.1,45.61 v83.8,44.91 v82.7,44.91
  Bottom 0.305: C7.1 91.83,28.92 U4.5 90.86,29.89 89.49,29.89 v89.4,29.8 | U3.5 26.12,57.38 C6.1 26.15,55.83 25.07,55.83 R35.2 | v87.9,31.2 85.55,33.55 R34.2
  Bottom 0.406: C6.1 26.12,53.5 47.7,53.5 v48.7,54.5 | v70.7,53 v52.4,53 | 79.2,46.4 74.9,50.7 v74.9,51.1 | R1.1 27.3,20.8 v27.4,20.8 29.4,20.8 R15.1 | R34.2 86.57,36.42 88.27,36.42 88.93,37.08 88.93,38.3 88.07,39.16 87.15,39.16 v82.5,43.81
  Bottom 0.508: 79.2,46.4 79.59,46.01 v81.9,46.01 82.4,45.51 84.7,45.51 | 84.7,43.78 84.7,45.51 | IC2.OUT 87.24,53.38 C15.+ 92.15,47.66 89.48,44.99 C13.1 88.26,45.51 84.7,45.51
  pour Bottom: 81.4,46.7 83.6,46.7 85,45.3 85,44 83.6,42.6 82.1,42.6 81,43.7 81,46.3
+12V  (via drill 0.35)
  Top 0.305: v61,78.5 61.28,78.78 82.05,78.78 X6.P$3
  Bottom 0.305: U$2.1 79.5,77.65 79.5,78.2 79.9,78.6 82.23,78.6 X6.P$3 | v61,78.5 59.95,77.45 D3.2 60.1,77.45 60.8,76.75 60.8,73.54 R42.2
  pour Bottom (isolate 0.305): 77.6,72.1 77.6,68.8 79.7,66.7 97.9,66.7 99.9,68.7 99.9,71.7 99.6,72 92.9,72 90.2,69.3 87.1,69.3 86.3,70.1 86.3,77.7 85.2,78.8 82.2,78.8 81.2,77.8 81.2,73.3 78.8,73.3
+18V  (via drill 0.35)
  Top 0.508: v41.6,17.4 37.5,13.3 22.58,13.3 v22.34,13.06
  Bottom 0.305: R54.2 49.3,14.75 Q11.E 49.2,14.92 48.09,16.02 48.09,16.8 47.6,17.3 T3.3 | T4.3 T3.3 | v41.6,17.4 42.6,18.4 T3.3 | R51.2 56.39,22.1 54.84,20.55 54.72,20.55 52.57,18.4 T3.3
  Bottom 0.406: 5.1,20.9 4.9,21.1 R49.2
  Bottom 0.508: R23.2 22.86,13.14 v22.34,13.06 21.6,13.8 12.2,13.8 5.1,20.9
  pour Bottom (isolate 0.406): 2.5,71.9 3.5,72.9 5.4,72.9 11.2,78.7 24.1,78.7 24.9,77.9 24.9,74.2 24.6,73.9 11.5,73.9 7.8,70.2 7.8,68.2 7.1,67.5 3.2,67.5 2.5,68.2
+UB
  Bottom 0.305: R36.2 47.83,26.19 49.7,28.06 49.7,29.22 54.81,34.34 54.81,47.18 52.58,49.41 50.8,49.41 49.7,50.52 49.7,57.8 54.43,62.53 54.62,62.53 | D3.1 59.1,74.95 59.1,69.81 Q13.8
  Bottom 2.54: X2.P$3 30.78,75.22 33.3,72.7 46.7,72.7 53,66.4 53,64.15 54.62,62.53 U$1.SWCOMMON 62.23,62.53 Q13.5
  pour Bottom (isolate 0.305): 60.2,66.9 61,67.7 63.3,67.7 64.4,66.6 64.4,62.4 63.8,61.8 58,61.8 57.9,61.9 57.9,63.8 58.6,64.5 59.8,64.5 60.2,64.9
GND  (via drill 0.35)
  Bottom 0.305: R31.1 79.42,16.12 v79.4,16.1 | C1.2 51.57,23.12 v51.52,23.07 | v53.42,23.07 53.44,23.09 C2.2 | v70.22,29.55 C3.2 | C4.2 55.08,23.06 v55.05,23.03 | OK4.2 v25.93,12.23 v25.92,12.24 | v33,12.5 33.27,12.23 OK4.3 | R56.2 43.2,19.7 v43.1,19.6 | R45.1 58.4,15.1 v58.91,15.61 | v57.3,25.7 57.3,24.85 R2.1 | R13.1 69.74,20.74 v69.8,20.8 | v63.85,14.81 IC1.11 IC1.12 | R22.2 v54.35,9.09 | C13.2 86.25,44.29 v86.23,44.31 | v27.15,61.25 27.15,60.05 U3.2 | C6.2 27.88,55.02 v28.2,54.7 | R19.1 22.4,57.2 v22.3,57.1 | R37.1 49.92,23.02 v49.9,23 | R6.1 v62.2,7.9 | C12.2 77.47,16.53 v77.5,16.5 | R18.1 52.75,19.8 52.95,20 53,20 v53.5,20.5 | R12.1 34.25,62.7 v32.9,62.7 | v64.7,60.3 63.35,60.3 R33.2 | R10.1 79.67,76.87 v80.2,77.4 | Q4.E 64.67,76.42 64.4,76.7 v64.4,76.8 | Q3.E 72.5,76.29 v72.5,75.5 | R43.1 63.15,68.95 v63.7,68.4 | C14.2 78.23,57.37 v78.3,57.3 | R9.1 78,78 v78.7,78 | R63.2 v23.1,14.3 | R41.2 v33.6,14.1 | OK1.2 77.47,56.53 v78.1,55.9 | U4.2 92.7,32.25 93.55,33.1 R38.1 94.3,33.5 v94.7,33.9 | C5.2 v49.41,73.21 v49.4,73.2 | T6.2 74.75,24.95 v74.7,25
  Bottom 0.406: C7.2 93.58,26.23 v93.6,26.2 | OK3.2 57.55,74.15 v57.7,74
  Bottom 0.508: C16.- 72.08,61.7 71.18,60.8 v71.1,60.8 | C15.- 85.12,49.2 v84.8,49.2 | v84.6,48 86.3,48 86.31,48.01 C15.- | C15.- 85.56,47.66 v84.9,47 | C15.- 86.2,48.12 v86.2,49.7 | v88.6,46.6 87.72,46.6 C15.- | T5.2 63.41,54.6 v61.4,54.6
  other vias: 79.4,13 81.4,12 80,12 80,14 82.8,12 84.6,13 81.3,14 82.6,14 83.8,14 83.3,13 82.1,13 80.7,13 84,12
  pour Bottom: 79.5,17.3 79.5,14.8 79.1,14.4 79.1,12.1 79.7,11.5 84.7,11.5 85.1,11.9 85.1,13.4 83.9,14.6 83.9,17.5 83.3,18.1 80.3,18.1
  pour Top (isolate 0.305): 0,80 0,0 100,0 100,80
N$1
  pour Bottom: 2.9,11.9 15.2,11.9 16.2,10.9 16.2,7.7 14.9,6.4 3.3,6.4 1.4,8.3 1.4,10.4
N$2
  Bottom 0.305: R60.2 63.96,58.42 64.73,57.65 64.73,56.63 64.83,56.53 OK1.3
N$3  (via drill 0.35)
  Top 0.305: v67,74.3 63.7,74.3 60.1,70.7 v60.1,69.9
  Bottom 0.305: R43.2 60.44,70.71 R42.1 60.1,71.13 v60.1,69.9 | Q4.B 66.78,74.53 v67,74.3
N$4
  Bottom 0.305: R32.1 64.89,78.07 R40.1 66.24,78.12 67.9,76.46 Q4.C
N$5
  Bottom 0.305: Q3.B 71.92,78.78 68.73,78.78 R32.2
N$6  (via drill 0.35)
  Top 0.305: v68.3,73.7 68.3,62.8 v69.3,61.8
  Bottom 0.305: v69.3,61.8 68.3,61.8 67.6,62.5 Q13.4 | R67.2 63.95,74.5 R39.1 63.02,72.73 Q2.4 67.33,72.73 v68.3,73.7 69.35,74.75 R66.2
N$7  (via drill 0.35)
  Top 0.305: v48.4,19.5 48.4,17.8 v45.3,14.7
  Top 2.54: R50.2 13.82,70.46 28.83,70.46 29.95,71.59 36.91,71.59 38.24,70.25 Q6.S
  Bottom 0.305: R17.2 49.47,19.5 v48.4,19.5 | R44.2 56.9,9.17 55.73,8 48.6,8 38.2,18.4 38.2,19.4 33.94,23.66 25.6,23.66 23.42,25.84 23.42,51.72 20.64,54.49 20.64,63.95 21.9,65.2 23.11,65.2 Q1.2 | 23.84,64.11 Q1.1 22.44,63.2 21.1,61.86 21.1,54.9 23.9,52.1 23.9,26.1 25.8,24.2 34.2,24.2 38.74,19.66 38.74,18.72 42.77,14.7 v45.3,14.7
  Bottom 0.813: Q1.3 Q1.2
  pour Bottom (isolate 0.406): 24.9,62.4 24.9,64.6 20.8,68.7 19.7,68.7 18.7,69.7 18.7,70 16.6,72.1 12.5,72.1 10.9,70.5 10.9,68.3 14.5,64.7 19.7,64.7 22.8,61.6 24.1,61.6
N$8
  Bottom 0.305: R40.2 62.62,78.12 61.9,77.4 D3.3 61.9,75.25 R67.1
N$9
  Bottom 0.305: R3.1 29.9,60 U3.3
  Bottom 2.54: R3.1 29.04,62.66 Q1.8 Q1.7 | Q1.7 Q1.6 | Q1.7 Q1.5 29.53,67.02 31.45,65.09 34.66,65.09 35.74,66.17 35.74,68.4 Q6.D
N$10
  Bottom 0.305: U$5.P$1 72.1,12.1 73.04,13.04 R4.2
N$11
  Bottom 0.305: IC1.10 65.1,13.08 65.17,13.01 R7.1 R6.2
N$12
  Bottom 0.305: R8.1 66.92,10.32 R16.2 66.39,10.85 IC1.9
N$13
  Bottom 0.305: U1.P$6 51.57,27.89 C1.1 51.52,26 R37.2 48.22,24.3 R36.1
N$14
  Bottom 0.305: U$2.5 75.81,74.91 75.52,74.91 75.17,74.55 R11.2
N$15
  Bottom 0.305: T1.1 66,23.05 R52.1
N$16
  Bottom 0.305: IC1.14 IC1.13
N$17
  Bottom 0.305: U$2.6 76.48,75.75 77.13,75.1 U$2.2 | R11.1 75.5,76.25 U$2.6 | R9.2 75.87,75.88 U$2.6
N$18
  Bottom 0.305: U$2.3 78.4,74.45 | 78.4,74.45 79.55,74.45 R10.2 | 78.4,74.45 76.67,72.72 Q8.4
N$19
  Bottom 0.305: IC1.3 62.6,18.32 62.6,21.3 T1.3 63.02,22.88 R14.1
N$20  (via drill 0.35)
  Top 0.305: v41.3,55.2 41.3,56.1 37.2,60.2 v37.2,63.5 36.55,63.5 R46.2
  Bottom 0.305: v41.3,55.2 41.2,55.1 39.59,55.1 Q5.4 | U$3.3 37.2,63.05 v37.2,63.5
N$21
  Bottom 0.305: T1.2 66.39,20.76 IC1.6 66.39,17.11 66.92,16.58 68.27,16.58 69.46,17.77 R13.2
N$22
  Bottom 0.305: R55.2 58.89,17.15 IC1.1
N$23
  Bottom 0.305: R8.2 70.25,7.95 71.2,8.9 U$5.P$2
N$24
  Bottom 0.305: R20.2 89.35,35.4 R34.1
N$25
  Bottom 0.305: R16.1 67.66,11.28 IC1.8 67.66,13.84 65.1,16.4 65.1,18.28 IC1.5
N$26
  Bottom 0.305: OK3.1 54.43,78.03 53.9,77.5 53.9,73.24 R21.1 53.9,73.21 C5.1
N$27
  Bottom 0.305: OK3.4 44.29,78.03 JP1.P$2
N$28
  Bottom 0.305: JP1.P$1 47.55,75.03 OK3.3
N$29
  Bottom 0.305: R23.1 24.39,10.09 25.65,10.09 26.05,9.69 OK4.1
N$30
  Bottom 0.305: R22.1 54.38,12.07 R44.1 61.31,16.48 IC1.2
N$31
  Bottom 0.305: R5.2 R35.1
N$32
  Bottom 0.305: R55.1 T2.1
N$33  (via drill 0.35)
  Top 0.305: v38.6,23 38.6,22.42 36,19.82 36,18.7 v35.8,18.5
  Bottom 0.305: v35.8,18.5 35.8,16.2 39.08,12.92 39.08,10.38 38.39,9.69 OK4.4 | v38.6,23 38.7,23.1 38.7,23.64 43.3,28.24 U1.P$3 45.36,30.6 47.1,30.6 50.9,34.4 R24.1
N$34
  Bottom 0.305: R47.1 39.2,60.65 U$3.6 37.22,60.64 36.57,61.3 U$3.2 35.62,61.3 35.27,60.95 R12.2
N$35
  Bottom 0.305: T6.3 73.8,21.14 73.8,20.93 R30.1 R64.1
N$36
  Bottom 0.305: R52.2 67.66,21.11 IC1.7
N$37  (via drill 0.35)
  Top 0.305: v40.2,21.1 39.1,21.1 v37.2,19.2 | v22.8,22.9 22.8,22.27 C11.1 | R25.1 21.9,47.71 v21.9,46.2
  Top 0.508: D4.C 21.98,21.45 C11.1
  Bottom 0.305: v37.2,19.2 37.2,19.6 33.9,22.9 v22.8,22.9 | v21.9,46.2 22.1,46 22.1,23.6 v22.8,22.9 | v22.8,22.9 20.31,22.9 S4.3 | v40.2,21.1 40.27,21.1 40.88,21.72 40.88,21.98 45.53,26.63 46.64,26.63 48.38,28.38 U1.P$5
N$38  (via drill 0.35)
  Top 0.305: v24.9,50.5 24.7,50.7 24.7,52.9 24.4,53.2 22.5,53.2 22,52.7 R26.1 | U1.P$9 57.08,30 40.52,30 39.52,29.01 39.52,26.81 38.95,26.23 38.8,26.23 v38.8,26.1
  Top 0.508: R26.1 17.74,52.25 S3.3 10.31,57.74 9.62,58.42 C10.1 9.04,58.75 D5.C
  Bottom 0.305: v38.8,26.1 33.9,26.1 29.1,30.9 29.1,48.2 26.8,50.5 v24.9,50.5
N$39
  Bottom 0.305: R51.1 60.45,22.1 61.32,22.97 R14.2 61.3,24.2 R2.2
N$40
  Bottom 0.305: U$3.5 38.15,61.3 R47.2
N$41
  Bottom 0.305: T2.2 56.05,16.9 R45.2 R53.1
N$42
  Bottom 0.305: Q2.3 R39.2
  pour Bottom (isolate 0.305): 64,72.1 64,68.7 65.7,67 65.7,63.3 66.1,62.9 69.8,62.9 69.9,63 69.9,65.8 67.7,68 67.7,72.5 67.6,72.6 64.5,72.6
N$43
  Bottom 0.305: U$3.4 37.7,62.95 38.25,63.5 40.4,63.5 40.9,63 40.9,60.7 39.5,59.3 Q5.1
  pour Bottom (isolate 0.305): 38.1,59.6 38.2,59.7 45.9,59.7 47.2,58.4 47.2,55.7 46,54.5 43.7,54.5 42.8,55.4 42.8,56.2 42.7,56.3 38.3,56.3 38.1,56.5
N$44
  Bottom 2.54: Q12.5 Q12.6 Q12.7 Q12.8 | X3.P$7 X3.P$5 X3.P$3 X3.P$1 90.75,23.2 87.22,19.67 Q12.5 | Q7.D 81.86,25.9 81.86,23.57 86.04,19.38 Q12.5
N$45  (via drill 0.35)
  Top 0.305: v55.5,64.8 v55.5,59.7 | U1.P$17 56,54.2 55.1,55.1 v55.1,55.2
  Bottom 0.305: R21.2 55.42,73.03 55.42,69.86 55.4,69.84 55.4,64.9 v55.5,64.8 | v55.5,59.7 55.2,59.4 55.2,55.2 v55.1,55.2
N$46  (via drill 0.35)
  Top 0.305: v73.6,30.79 73.6,28.4 v73.7,28.3
  Bottom 0.305: U1.P$16 58.54,44.46 72.21,30.79 v73.6,30.79 | R65.1 72.8,27.94 73.16,28.3 v73.7,28.3
N$47  (via drill 0.35)
  Top 0.305: U1.P$4 45.84,24.09 R58.2 | v39.3,22.2 39.23,22.2 36.52,19.48 36.52,18.92 37,18.43 v37,18
  Bottom 0.305: U1.P$4 39.5,22.2 v39.3,22.2 | v37,18 37.8,18 48.26,7.54 55.92,7.54 58.73,10.35 R7.2
N$48  (via drill 0.35)
  Top 0.305: v43.8,31.7 59.5,31.7 v59.6,31.6
  Bottom 0.305: v43.8,31.7 43.7,31.6 41.82,31.6 39.52,29.31 39.52,27.41 39.25,27.13 34.06,27.13 30,31.2 30,45.63 29.92,45.72 29.92,48.06 23.45,54.54 23.45,59.15 22.55,60.05 R19.2 R5.1 24.55,60 U3.1 | v59.6,31.6 59.77,31.42 59.77,27.94 60.48,27.23 62.31,27.23 U1.P$11 65.03,27.13 67.38,27.13 C3.1
N$49
  Bottom 0.305: R53.2 52.85,13.65 52.4,13.2 47.4,13.2 47,13.6 Q11.C 47,15.85 T3.1
N$50  (via drill 0.35)
  Top 0.305: v35.3,19.7 35.3,20.1 37.9,22.7 37.9,23.27 38.33,23.7 39.4,23.7 39.6,23.5 v39.6,23.4 | U1.P$21 45.58,51.66 C17.1
  Bottom 0.305: JP4.1 v35.3,19.7 | v39.6,23.4 39.96,23.4 44.6,28.04 44.6,29.11 45.64,30.15 47.37,30.15 52.3,35.08 52.3,45.1 49.4,48 49.24,48 U1.P$21
N$51
  Bottom 0.305: R17.1 R18.2 52.4,21.95 55.35,21.95 56.3,22.9 56.3,25.44 55.68,26.05 C4.1 56,26.98 U1.P$8
N$52
  Bottom 0.305: U$3.1 36.1,59.8 35.3,59 Q5.8 | 29.2,57.4 30.6,56 | R3.2 30.75,55.35 30.1,56 28.7,57.4 U3.4
  Bottom 0.813: Q5.6 33.63,57.13 32.27,57.13 31.14,56 30.6,56 30.1,56
  pour Bottom (isolate 0.406): 29.2,54.6 29.2,57.6 29.5,57.9 32,57.9 32.3,58.2 32.3,58.8 33.4,59.9 36.2,59.9 36.3,59.8 36.3,55.1 35.4,54.2 29.6,54.2
N$53
  Bottom 0.305: R48.1 R1.2 27.3,14.4 27.7,14 29.2,14 30.09,13.11 30.09,7.51 JP3.P$2
N$54
  Bottom 0.305: T2.3 53.6,17.7 52.45,17.7 51.2,16.45 R54.1 51,16.55 Q11.B
N$55
  Bottom 0.305: C2.1 53.4,26.09 53.4,28.48 U1.P$7 53.46,28.94 52.86,29.54 52.86,30.67 55.26,33.08 68.84,33.08 72.43,29.48 87.83,29.48 89.95,31.6 U4.1 91.85,31.7 R38.2 89.3,33.5 89.28,33.52 R20.1
N$56
  Bottom 0.305: JP2.P$2 35.78,6.44 32.38,6.44 31,7.82 31,13.85 R15.2 R62.1
N$57
  Bottom 0.305: R30.2 77.11,19.37 C12.1 R31.2 | Q12.4 79.44,19.38 R31.2 | Q7.G 79.36,19.42 R31.2
N$58
  Bottom 0.305: R65.2 72.8,23.65 T6.1
N$59
  Bottom 0.305: JP4.2 31.5,19.33 R62.2 R41.1
N$60
  Bottom 0.305: R66.1 70.02,76.03 Q3.C
N$61  (via drill 0.35)
  Top 0.305: v37.11,23.31 37.11,22.71 35.3,20.9 34.9,20.9 v34.1,21.7 | U1.P$20 47.5,52.28 C18.1
  Bottom 0.305: R63.1 R48.2 25.2,19.91 27,21.7 v34.1,21.7 | v37.11,23.31 37.11,23.03 38.72,21.42 39.48,21.42 45.3,27.23 46.44,27.23 47.15,27.94 47.15,29.28 52.96,35.09 52.96,45.09 48.38,49.67 U1.P$20
N$62  (via drill 0.35)
  Top 0.305: v73,33 72.53,33 71.48,31.94 69.14,31.94 67.14,29.95 62.48,29.95 U1.P$10
  Top 0.508: S1.3 85.75,37.87 C8.1 83.25,35.38 D6.C
  Bottom 0.305: U1.P$10 61.08,29.1 R28.1 | S1.3 84.5,37.3 77.3,37.3 v73,33
N$64  (via drill 0.35)
  Top 0.305: v48.8,53.1 49.7,52.2 49.7,50.6 50.3,50 59.74,50 61.08,51.34 U1.P$15 | v30.6,46 26.86,42.26 S2.3 18.16,42.26 C9.1 16.52,44.77 D7.C
  Top 0.406: 18.75,49.05 17.05,47.35 D7.C
  Top 0.508: 18.75,49.05 19.8,50.1 21.94,50.1 R27.1
  Bottom 0.305: v30.6,46 31.76,47.16 31.76,50.56 34,52.8 48.5,52.8 v48.8,53.1
N$65
  Bottom 0.305: T4.2 45.2,22.55 R56.1 42.55,22.55 41.8,21.8 41.8,19.85 R57.1
N$66  (via drill 0.35)
  Top 0.508: U$1.COIL0 52.97,64.48 D1.A 53.08,60.7 v54.6,60.7
  Bottom 0.508: T5.3 56.4,60.7 v54.6,60.7
N$67
  Bottom 0.305: T3.2 T4.1
N$68  (via drill 0.35)
  Top 0.305: v26.9,49.3 27.6,50 27.6,54.22 24.56,57.25 24.56,65.76 v25.8,67
  Bottom 0.305: R57.2 39.75,19.6 34.53,24.81 26.09,24.81 24.5,26.4 24.5,46.87 26.6,48.97 26.6,49 v26.9,49.3 | Q6.G 30.94,68.44 30.49,68.89 26.99,68.89 25.8,67.7 v25.8,67 23.86,67 Q1.4
N$69
  Top 0.508: D1.C 56.84,56.71 U$1.COIL1 57.05,56.56 R59.2
N$71
  Bottom 0.305: T5.1 63.41,56.67 R60.1 R33.1
N$72
  Bottom 0.305: U1.P$19 50.92,52.7 51.94,53.72 75.43,53.72 76.35,52.8 78.6,52.8 79.45,53.65 R61.1
N$73
  Bottom 0.305: R61.2 75.15,54.6 73.97,55.78 73.97,59.07 OK1.1
N$74
  Bottom 0.305: U4.4 94.95,27.7 95.8,27.7 95.99,27.51 R29.1
  Bottom 2.54: X3.P$8 X3.P$6 X3.P$4 X3.P$2 97.25,27.45 R29.1
VCC  (via drill 0.35)
  Top 0.406: v72.57,31.64 72.57,29.5 v71.91,28.84 | v66.7,15.9 66.6,16 64.5,16 63.73,16.77 C19.1 63.73,20.02 v63.8,20.1
  Top 0.508: R59.1 64.7,58.79 v64.7,59
  Bottom 0.305: U$2.4 76,74.05 75.48,73.53 72.8,73.53 72,72.73 71.2,72.73 Q2.5 | C14.1 78.78,60.85 80.45,60.85 | U4.3 95.16,33.11 R29.2
  Bottom 0.406: v71.91,28.84 71.32,28.25 71.32,18.9 | v66.7,15.9 67.01,15.59 R4.1 71.32,15.61 71.32,18.9 | IC1.4 63.8,18.35 v63.8,20.1 | R64.2 72.57,17.65 71.32,18.9
  Bottom 0.508: v72.57,31.64 72.57,31.93 71.3,33.2 71.3,48.8 74.6,52.1 81,52.1 81.8,52.9 81.8,59.5 80.45,60.85 C16.+ 76.36,60.88 74.09,60.88 72.28,59.07 OK1.4 64.77,59.07 v64.7,59
  Bottom 0.813: Q2.6 Q8.3 | Q8.2 Q2.7 | Q2.7 | Q2.8 Q8.1 | Q2.5 69.33,72.73 69,72.4 69,71.5 | 69,71.5 69,70.2 69.02,70.19 Q2.7 | Q2.6 71.2,71.67 71.2,72.73 | Q2.6 69.04,71.46 69,71.5
  Bottom 2.54: R29.2 97.29,33.21 97.29,59.61 D2.C
  pour Bottom (isolate 0.305): 69,71.8 69.5,72.3 74.6,72.3 75.3,71.6 75.3,68.4 78.6,65.1 95.8,65.1 98.8,62.1 98.8,58.5 97.3,57 92.1,57 90.8,58.3 85.5,58.3 83,60.8 76.7,60.8 75.1,62.4 75.1,64.3 72.7,66.7 71.3,66.7 69,69

### Text on the board
bPlace: БП | АКБ | 13B | Напр. | Упр. | LED | Темп2 | Темп.1